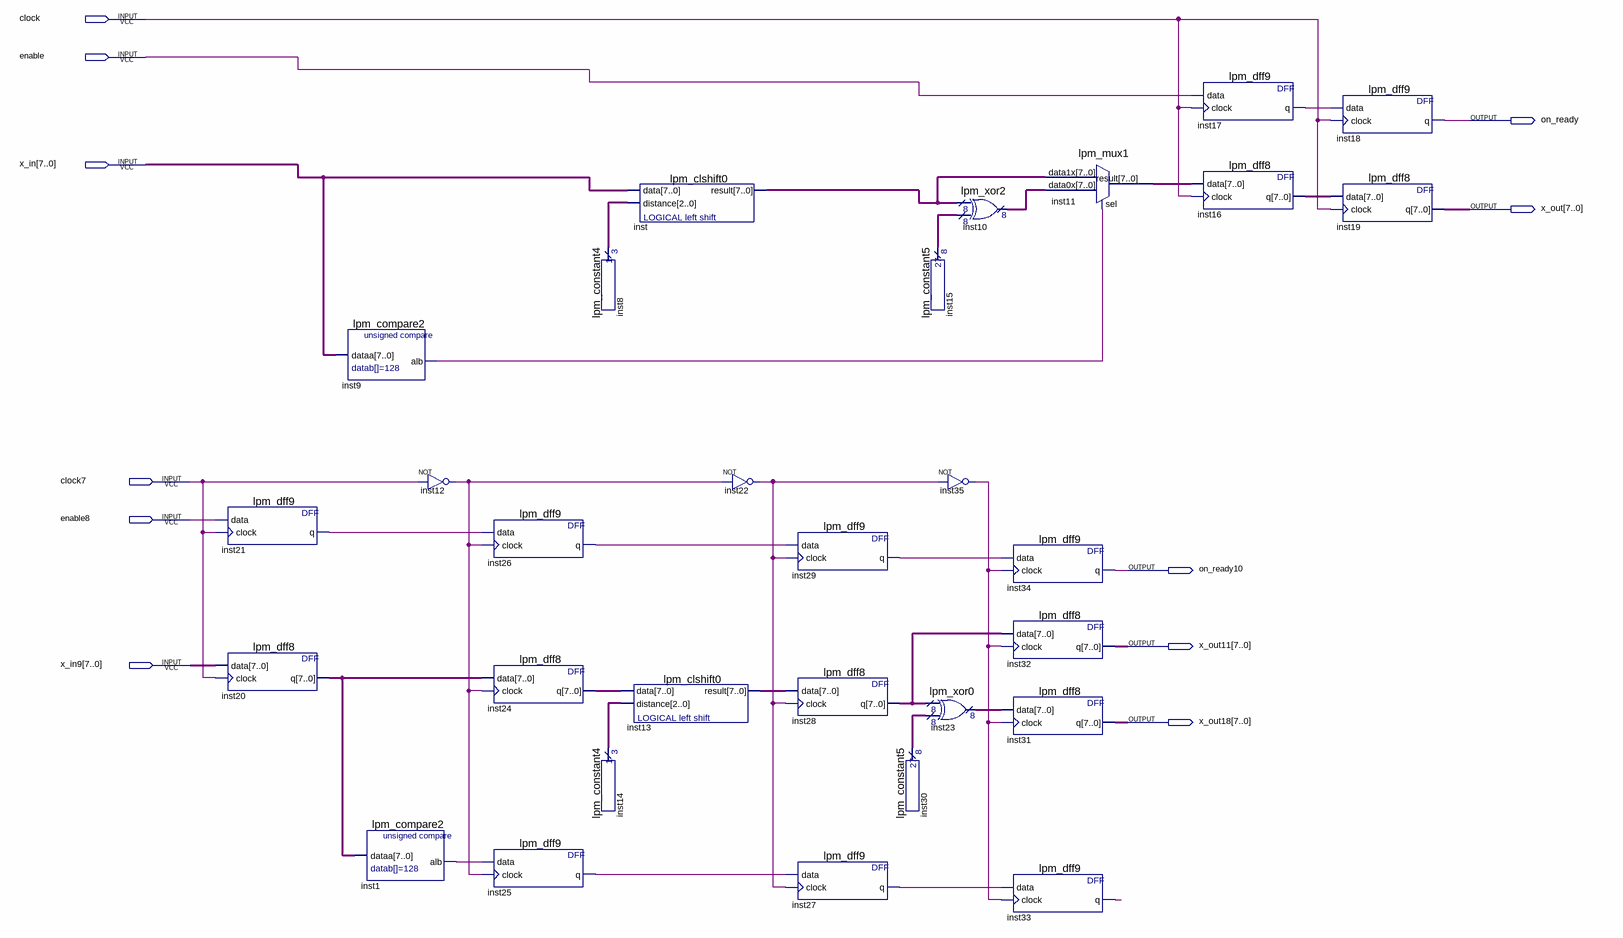
[diagram p0: schematic sheet]
// Quartus schematic mul02_2.bdf as structural Verilog: 30 symbols, 11 pins
module mul02_2 (
  input  clock,
  input  enable,
  input  [7:0] x_in,
  input  clock7,
  input  enable8,
  input  [7:0] x_in9,
  output on_ready,
  output [7:0] x_out,
  output on_ready10,
  output [7:0] x_out11,
  output [7:0] x_out18
);

  wire inst1_alb, inst9_alb, inst12_out, inst17_q, inst21_q, inst22_out, inst25_q, inst26_q, inst27_q,
       inst29_q, inst33_q, inst35_out;
  wire [2:0] inst8_result, inst14_result;
  wire [7:0] inst10_result, inst11_result, inst13_result, inst15_result, inst16_q, inst20_q, inst23_result,
       inst24_q, inst28_q, inst30_result, inst_result;

  lpm_dff9 inst21 (.data(enable8), .clock(clock7), .q(inst21_q));
  lpm_dff8 inst20 (.data(x_in9), .clock(clock7), .q(inst20_q));
  lpm_compare2 inst9 (.dataa(x_in), .alb(inst9_alb));
  lpm_compare2 inst1 (.dataa(inst20_q), .alb(inst1_alb));
  not inst12 (inst12_out, clock7);
  lpm_dff9 inst26 (.data(inst21_q), .clock(inst12_out), .q(inst26_q));
  lpm_dff8 inst24 (.data(inst20_q), .clock(inst12_out), .q(inst24_q));
  lpm_dff9 inst25 (.data(inst1_alb), .clock(inst12_out), .q(inst25_q));
  lpm_constant4 inst8 (.result(inst8_result));
  lpm_constant4 inst14 (.result(inst14_result));
  lpm_clshift0 inst (.data(x_in), .distance(inst8_result), .result(inst_result));
  lpm_clshift0 inst13 (.data(inst24_q), .distance(inst14_result), .result(inst13_result));
  not inst22 (inst22_out, inst12_out);
  lpm_dff9 inst29 (.data(inst26_q), .clock(inst22_out), .q(inst29_q));
  lpm_dff8 inst28 (.data(inst13_result), .clock(inst22_out), .q(inst28_q));
  lpm_dff9 inst27 (.data(inst25_q), .clock(inst22_out), .q(inst27_q));
  lpm_constant5 inst30 (.result(inst30_result));
  lpm_constant5 inst15 (.result(inst15_result));
  not inst35 (inst35_out, inst22_out);
  lpm_xor0 inst23 (.data0x(inst28_q), .data1x(inst30_result), .result(inst23_result));
  lpm_xor2 inst10 (.data0x(inst_result), .data1x(inst15_result), .result(inst10_result));
  lpm_dff9 inst34 (.data(inst29_q), .clock(inst35_out), .q(on_ready10));
  lpm_dff8 inst32 (.data(inst28_q), .clock(inst35_out), .q(x_out11));
  lpm_dff8 inst31 (.data(inst23_result), .clock(inst35_out), .q(x_out18));
  lpm_dff9 inst33 (.data(inst27_q), .clock(inst35_out), .q(inst33_q));
  lpm_mux1 inst11 (.data1x(inst_result), .data0x(inst10_result), .sel(inst9_alb), .result(inst11_result));
  lpm_dff9 inst17 (.data(enable), .clock(clock), .q(inst17_q));
  lpm_dff8 inst16 (.data(inst11_result), .clock(clock), .q(inst16_q));
  lpm_dff9 inst18 (.data(inst17_q), .clock(clock), .q(on_ready));
  lpm_dff8 inst19 (.data(inst16_q), .clock(clock), .q(x_out));
endmodule
